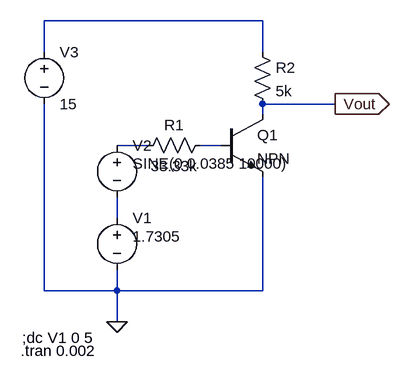
[diagram p0: schematic final.asc.asc]
final.asc.asc, the LTspice schematic file:
Version 4
SHEET 1 1076 680
WIRE 112 -48 -224 -48
WIRE -224 0 -224 -48
WIRE 112 0 112 -48
WIRE 224 80 112 80
WIRE 112 96 112 80
WIRE -64 144 -112 144
WIRE 48 144 16 144
WIRE -112 256 -112 224
WIRE -224 368 -224 80
WIRE -112 368 -112 336
WIRE -112 368 -224 368
WIRE 112 368 112 192
WIRE 112 368 -112 368
WIRE -112 416 -112 368
FLAG 224 80 Vout
IOPIN 224 80 Out
FLAG -112 416 0
SYMBOL npn 48 96 R0
SYMATTR InstName Q1
SYMBOL res 32 128 R90
WINDOW 0 0 56 VBottom 2
WINDOW 3 32 56 VTop 2
SYMATTR InstName R1
SYMATTR Value 33.33k
SYMBOL voltage -112 240 R0
WINDOW 123 0 0 Left 0
WINDOW 39 0 0 Left 0
WINDOW 3 24 44 Left 2
SYMATTR InstName V1
SYMATTR Value 1.7305
SYMBOL voltage -112 128 R0
WINDOW 123 0 0 Left 0
WINDOW 39 0 0 Left 0
WINDOW 3 24 44 Left 2
SYMATTR InstName V2
SYMATTR Value SINE(0 0.0385 10000)
SYMBOL res 96 -16 R0
SYMATTR InstName R2
SYMATTR Value 5k
SYMBOL voltage -224 -16 R0
WINDOW 123 0 0 Left 0
WINDOW 39 0 0 Left 0
SYMATTR InstName V3
SYMATTR Value 15
TEXT -258 440 Left 2 !;dc V1 0 5
TEXT -260 460 Left 2 !.tran 0.002

The netlist it stands for:
* final.asc.asc
Q1 Vout N003 0 0 NPN
R1 N003 N002 33.33k
V1 N004 0 1.7305
V2 N002 N004 SINE(0 0.0385 10000)
R2 N001 Vout 5k
V3 N001 0 15
.model NPN NPN
.model PNP PNP
.lib standard.bjt
;dc V1 0 5
.tran 0.002
.backanno
.end